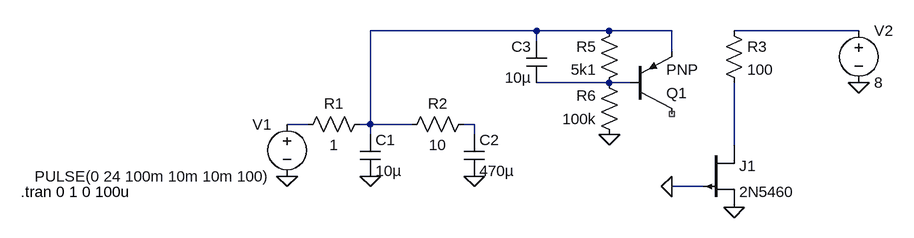
[diagram p0: schematic Draft4.asc]
Draft4.asc, the LTspice schematic file:
Version 4
SHEET 1 880 680
WIRE 208 -64 -48 -64
WIRE 320 -64 208 -64
WIRE 416 -64 320 -64
WIRE 704 -64 512 -64
WIRE 208 -48 208 -64
WIRE 416 -32 416 -64
WIRE 320 16 208 16
WIRE 352 16 320 16
WIRE -144 80 -176 80
WIRE -48 80 -48 -64
WIRE -48 80 -64 80
WIRE 16 80 -48 80
WIRE 112 80 96 80
WIRE -48 96 -48 80
WIRE 112 96 112 80
WIRE 512 112 512 16
WIRE 464 176 416 176
FLAG -176 160 0
FLAG 512 208 0
FLAG -48 160 0
FLAG 112 160 0
FLAG 320 96 0
FLAG 704 16 0
FLAG 416 176 0
SYMBOL voltage -176 64 M0
WINDOW 123 0 0 Left 0
WINDOW 39 0 0 Left 0
SYMATTR InstName V1
SYMATTR Value PULSE(0 24 100m 10m 10m 100)
SYMBOL pjf 464 112 R0
SYMATTR InstName J1
SYMATTR Value 2N5460
SYMBOL res -48 64 R90
WINDOW 0 0 56 VBottom 2
WINDOW 3 32 56 VTop 2
SYMATTR InstName R1
SYMATTR Value 1
SYMBOL cap -64 96 R0
SYMATTR InstName C1
SYMATTR Value 10µ
SYMBOL res 112 64 R90
WINDOW 0 0 56 VBottom 2
WINDOW 3 32 56 VTop 2
SYMATTR InstName R2
SYMATTR Value 10
SYMBOL cap 96 96 R0
SYMATTR InstName C2
SYMATTR Value 470µ
SYMBOL res 496 -80 R0
SYMATTR InstName R3
SYMATTR Value 100
SYMBOL res 336 -80 M0
SYMATTR InstName R5
SYMATTR Value 5k1
SYMBOL res 336 112 R180
WINDOW 0 36 76 Left 2
WINDOW 3 36 40 Left 2
SYMATTR InstName R6
SYMATTR Value 100k
SYMBOL cap 224 -48 M0
SYMATTR InstName C3
SYMATTR Value 10µ
SYMBOL voltage 704 -80 R0
WINDOW 123 0 0 Left 0
WINDOW 39 0 0 Left 0
SYMATTR InstName V2
SYMATTR Value 8
SYMBOL pnp 352 64 M180
SYMATTR InstName Q1
TEXT -586 184 Left 2 !.tran 0 1 0 100u

The netlist it stands for:
* Draft4.asc
V1 N004 0 PULSE(0 24 100m 10m 10m 100)
J1 N006 0 0 2N5460
R1 N001 N004 1
C1 N001 0 10µ
R2 N005 N001 10
C2 N005 0 470µ
R3 N002 N006 100
R5 N001 N003 5k1
R6 0 N003 100k
C3 N001 N003 10µ
V2 N002 0 8
Q1 NC_01 N003 N001 0 PNP
.model NPN NPN
.model PNP PNP
.lib standard.bjt
.model NJF NJF
.model PJF PJF
.lib standard.jft
.tran 0 1 0 100u
.backanno
.end